# Altium schematic sheet [13] PWR1.SchDoc: Power supply
size A4; Engineer: M. Folejewski; DocumentNumber: 13; SheetNumber: 13; SheetTotal: 17; PageSize: A4; Designators: 900-949
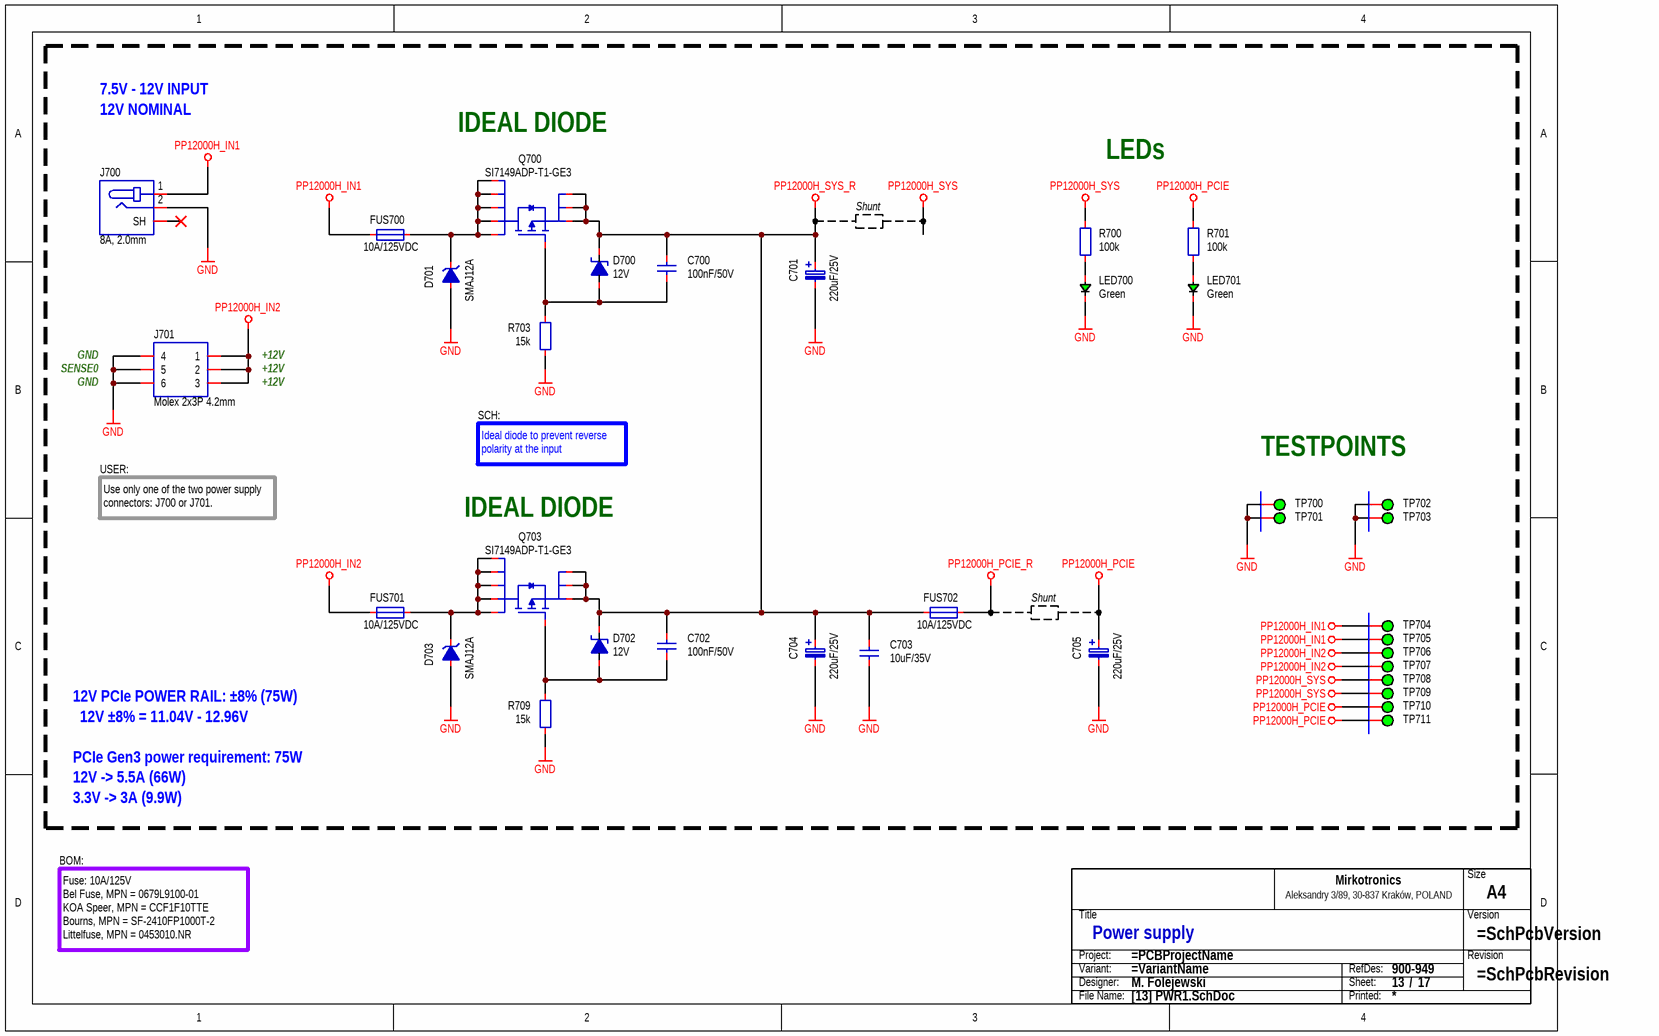
[diagram p0: [13] PWR1.SchDoc]

## Parts
C700  100nF/50V  [CAP_0603_R]
C701  220uF/25V  [CAP_SMD_SIZE_D8]
C702  100nF/50V  [CAP_0603_R]
C703  10uF/35V  [CAP_1206_R]
C704  220uF/25V  [CAP_SMD_SIZE_D8]
C705  220uF/25V  [CAP_SMD_SIZE_D8]
D700  12V  [PKG_SOT23-3_TO236]
D701  SMAJ12A  [DIO_SMA_UNI_R]
D702  12V  [PKG_SOT23-3_TO236]
D703  SMAJ12A  [DIO_SMA_UNI_R]
FUS700  10A/125VDC  [FUS_2410_R]
FUS701  10A/125VDC  [FUS_2410_R]
FUS702  10A/125VDC  [FUS_2410_R]
J700  8A, 2.0mm  [CON_CUI_PJ-063AH]
J701  Molex 2x3P 4.2mm  [CON_MLX_039301060]
LED700  Green  [LED_0805_GRN_R]
LED701  Green  [LED_0805_GRN_R]
Q700  MPN: SI7149ADP-T1-GE3  [ICC_SO8_POWERPAK_490X590X112_P127_R]  (hidden comment: PMOS)
Q703  MPN: SI7149ADP-T1-GE3  [ICC_SO8_POWERPAK_490X590X112_P127_R]  (hidden comment: PMOS)
R700  100k  [RES_0603_R]
R701  100k  [RES_0603_R]
R703  15k  [RES_0603_R]
R709  15k  [RES_0603_R]
TB?  Title block  (value not drawn)  (graphical)
TP700  ICT  [PCB_TP_ICT_100]  (value not drawn)  (no BOM)
TP701  ICT  [PCB_TP_ICT_100]  (value not drawn)  (no BOM)
TP702  ICT  [PCB_TP_ICT_100]  (value not drawn)  (no BOM)
TP703  ICT  [PCB_TP_ICT_100]  (value not drawn)  (no BOM)
TP704  ICT  [PCB_TP_ICT_100]  (value not drawn)  (no BOM)
TP705  ICT  [PCB_TP_ICT_100]  (value not drawn)  (no BOM)
TP706  ICT  [PCB_TP_ICT_100]  (value not drawn)  (no BOM)
TP707  ICT  [PCB_TP_ICT_100]  (value not drawn)  (no BOM)
TP708  ICT  [PCB_TP_ICT_100]  (value not drawn)  (no BOM)
TP709  ICT  [PCB_TP_ICT_100]  (value not drawn)  (no BOM)
TP710  ICT  [PCB_TP_ICT_100]  (value not drawn)  (no BOM)
TP711  ICT  [PCB_TP_ICT_100]  (value not drawn)  (no BOM)

## Nets
GND: C701.1 C703.1 C704.1 C705.1 D701.2(A) D703.2(A) J700.2 J701.4 J701.5 J701.6 LED700.1 LED701.1 R703.1 R709.1 TP700.1 TP701.1 TP702.1 TP703.1
PP12000H_IN1: FUS700.1 J700.1 TP704.1 TP705.1
PP12000H_IN2: FUS701.1 J701.1 J701.2 J701.3 TP706.1 TP707.1
PP12000H_PCIE: C705.2 R701.2 TP710.1 TP711.1
PP12000H_PCIE_R: FUS702.2
PP12000H_SYS: R700.2 TP708.1 TP709.1
PP12000H_SYS_R: C700.2 C701.2 C702.2 C703.2 C704.2 D700.3(K) D702.3(K) FUS702.1 Q700.1(S) Q700.2(S) Q700.3(S) Q703.1(S) Q703.2(S) Q703.3(S)
NetC700_1: C700.1 D700.1(A) Q700.4(G) R703.2
NetC702_1: C702.1 D702.1(A) Q703.4(G) R709.2
NetD701_1: D701.1(K) FUS700.2 Q700.5(D) Q700.6(D) Q700.7(D) Q700.8(D) Q700.EP(D)
NetD703_1: D703.1(K) FUS701.2 Q703.5(D) Q703.6(D) Q703.7(D) Q703.8(D) Q703.EP(D)
NetLED700_2: LED700.2 R700.1
NetLED701_2: LED701.2 R701.1

Not connected (* = marked no-connect by the designer): J700 SH*

## Notes on the sheet
- 7.5V - 12V INPUT
- 12V NOMINAL
- (near Q700) IDEAL DIODE
- LEDs
- Shunt
- GND
- SENSE0
- +12V
- SCH:
- Use only one of the two power supply connectors: J700 or J701.
- USER:
- (near Q703) IDEAL DIODE
- Ideal diode to prevent reverse polarity at the input
- TESTPOINTS
- 12V PCIe POWER RAIL: ±8% (75W)
- PCIe Gen3 power requirement: 75W
- 12V -> 5.5A (66W)
- 12V ±8% = 11.04V - 12.96V
- 3.3V -> 3A (9.9W)
- BOM:
- Fuse: 10A/125V
  Bel Fuse, MPN = 0679L9100-01
  KOA Speer, MPN = CCF1F10TTE
  Bourns, MPN = SF-2410FP1000T-2
  Littelfuse, MPN = 0453010.NR
- (in symbol SCH_TITLE_BLOCK_MIRKOTRONICS_V2) Size; Mirkotronics; Aleksandry 3/89, 30-837 Kraków, POLAND; Title; Version; Project:; Revision; Variant:; RefDes:; Designer:; Sheet:; /; File Name:; Printed:

## Library data of the parts
C700 C702 = CAP-0008: Capacitor; MLCC; 100nF; TBD; TBD; TBD; TBD; SMD; 0603 (1608);; Component Type: Capacitor; Component Subtype: MLCC; Value: 100nF/50V; Manufacturer: TBD; MPN: TBD; Mounting Type: SMD; Package (Case): 0603 (1608); Supplier: ?; Supplier 1: LCSC; Supplier Part Number 1: C14663
C701 C704 C705 = CAP_POL_2P_NP: Capacitor; Polarized;; Manufacturer: Panasonic; MPN: EEEFTE221XAP; Component Subtype: Electrolytic; Package (Case): SMD SIZE D8; Component Type: Capacitor; Mounting Type: SMD; Value: 220uF/25V; Supplier 1: LCSC; Supplier Part Number 1: C2918361
C703 = CAP-0025: Capacitor; MLCC; GENERIC; TBD; TBD; TBD; TBD; SMD; 1206 (3216);; Component Type: Capacitor; Component Subtype: MLCC; Value: 10uF/35V; Manufacturer: GENERIC; MPN: GENERIC; Mounting Type: SMD; Package (Case): 1206 (3216); Supplier: ?; Supplier 1: LCSC; Supplier Part Number 1: C92797
D700 D702 = DIO_ZEN_A_K: Diode; Zener;; MPN: MMBZ5242BLT3G; Manufacturer: ON Semi; Value: 12V; Supplier 1: LCSC; Supplier Part Number 1: C896784
D701 D703 = DIO_TVS_UNI_KA: Diode; Schottky; Unipolar;; Manufacturer: Littelfuse; Component Subtype: TVS Diode; Value: SMAJ12A; MPN: SMAJ12A; Component Type: Diode; Mounting Type: SMD; Supplier: ?; Supplier 1: LCSC; Supplier Part Number 1: C713694
FUS700-FUS702 = FUS: Fuse; Manufacturer: Bel Fuse; MPN: 0679L9100-01; Value: 10A/125VDC; Supplier 1: LCSC; Supplier Part Number 1: C2838934
J700 = CON_DC_A1_SH: Connector; DC Barrel Jack;; Manufacturer: CUI Devices; MPN: PJ-063AH; Package (Case): THT; Component Subtype: DC Barrel Jack; Component Type: Connector; Mounting Type: THT; Supplier 1: Mouser; Value: 8A, 2.0mm; Supplier Part Number 1: 490-PJ-063AH
J701 = CON_2X03_COL: Connector; 2 Row;; Component Subtype: Wire to Board; Package (Case): THT; Component Type: Connector; Manufacturer: Molex; Mounting Type: THT; MPN: 039-30-1060; Supplier 1: LCSC; Supplier Part Number 1: C54904; Value: Molex 2x3P 4.2mm
LED700 LED701 = DIO_LED_GRN: Diode; LED; Green;; Manufacturer: Foshan NationStar Optoelectronics; MPN: NCD0805G1; Component Subtype: LED Diode; Package (Case): 0805 (2012); Value: Green; Component Type: LED; Mounting Type: SMD; Supplier: LCSC; Supplier 1: LCSC; Supplier Part Number 1: C84260
Q700 Q703 = TRA_PMOS_SSSGDDDD_EP: Transistor; PMOS;; Manufacturer: Vishay; Component Subtype: P-MOSFET; Package (Case): PowerPAK-SO-8; Component Type: Transistor; Mounting Type: SMD; Supplier 1: LCSC; Supplier Part Number 1: C554002; Value: PMOS
R700 R701 = RES-0029: Resistor; Thick Film; 100k; 1%; 100mW; 100PPM; 75V; Standard; SMD; 0603 (1608);; Manufacturer: Yageo Corporation; MPN: TBD; Component Body: 1.60 x 0.80mm; Packaging Type: Tape & Reel; ID: RES-0029; Component Type: Resistor; Component Subtype: Thick Film; Value: 100k; Mounting Type: SMD; Package (Case): 0603 (1608); Component Height: 0.45mm; ROHS Status: RoHS Compliant; Operating Temperature: -55°C to +155°C; Resistance: 100k; Tolerance: 1%; Power Rating: 100mW; TCR: 100PPM; Voltage Rating: 75V; Features: Standard; Supplier 1: LCSC; Supplier Part Number 1: C25803
R703 R709 = RES-0043: Resistor; Thick Film; 15k; 1%; 100mW; 100PPM; 75V; Standard; SMD; 0603 (1608);; Manufacturer: Yageo Corporation; MPN: TBD; Component Type: Resistor; Component Subtype: Thick Film; Value: 15k; Mounting Type: SMD; Package (Case): 0603 (1608); Supplier: ?; Supplier 1: LCSC; Supplier Part Number 1: C22809
TB? = SCH_TITLE_BLOCK_MIRKOTRONICS_V2: Component Type: Title block; Manufacturer: -; Mounting Type: Non component; MPN: -; Operating Temperature: -; Package: -; Specification: Title block; Value: Title block; Replacement: -; System: ?
TP700-TP711 = PCB_TP_ICT: Test Point (ICT); Specification: Testpoint (for ICT), SMD pad; Component Type: Testpoint (for ICT); Manufacturer: -; Mounting Type: Non component; MPN: -; Value: ICT